# EAGLE board power_distribution (EAGLE 9.6.2), part 1 of 3
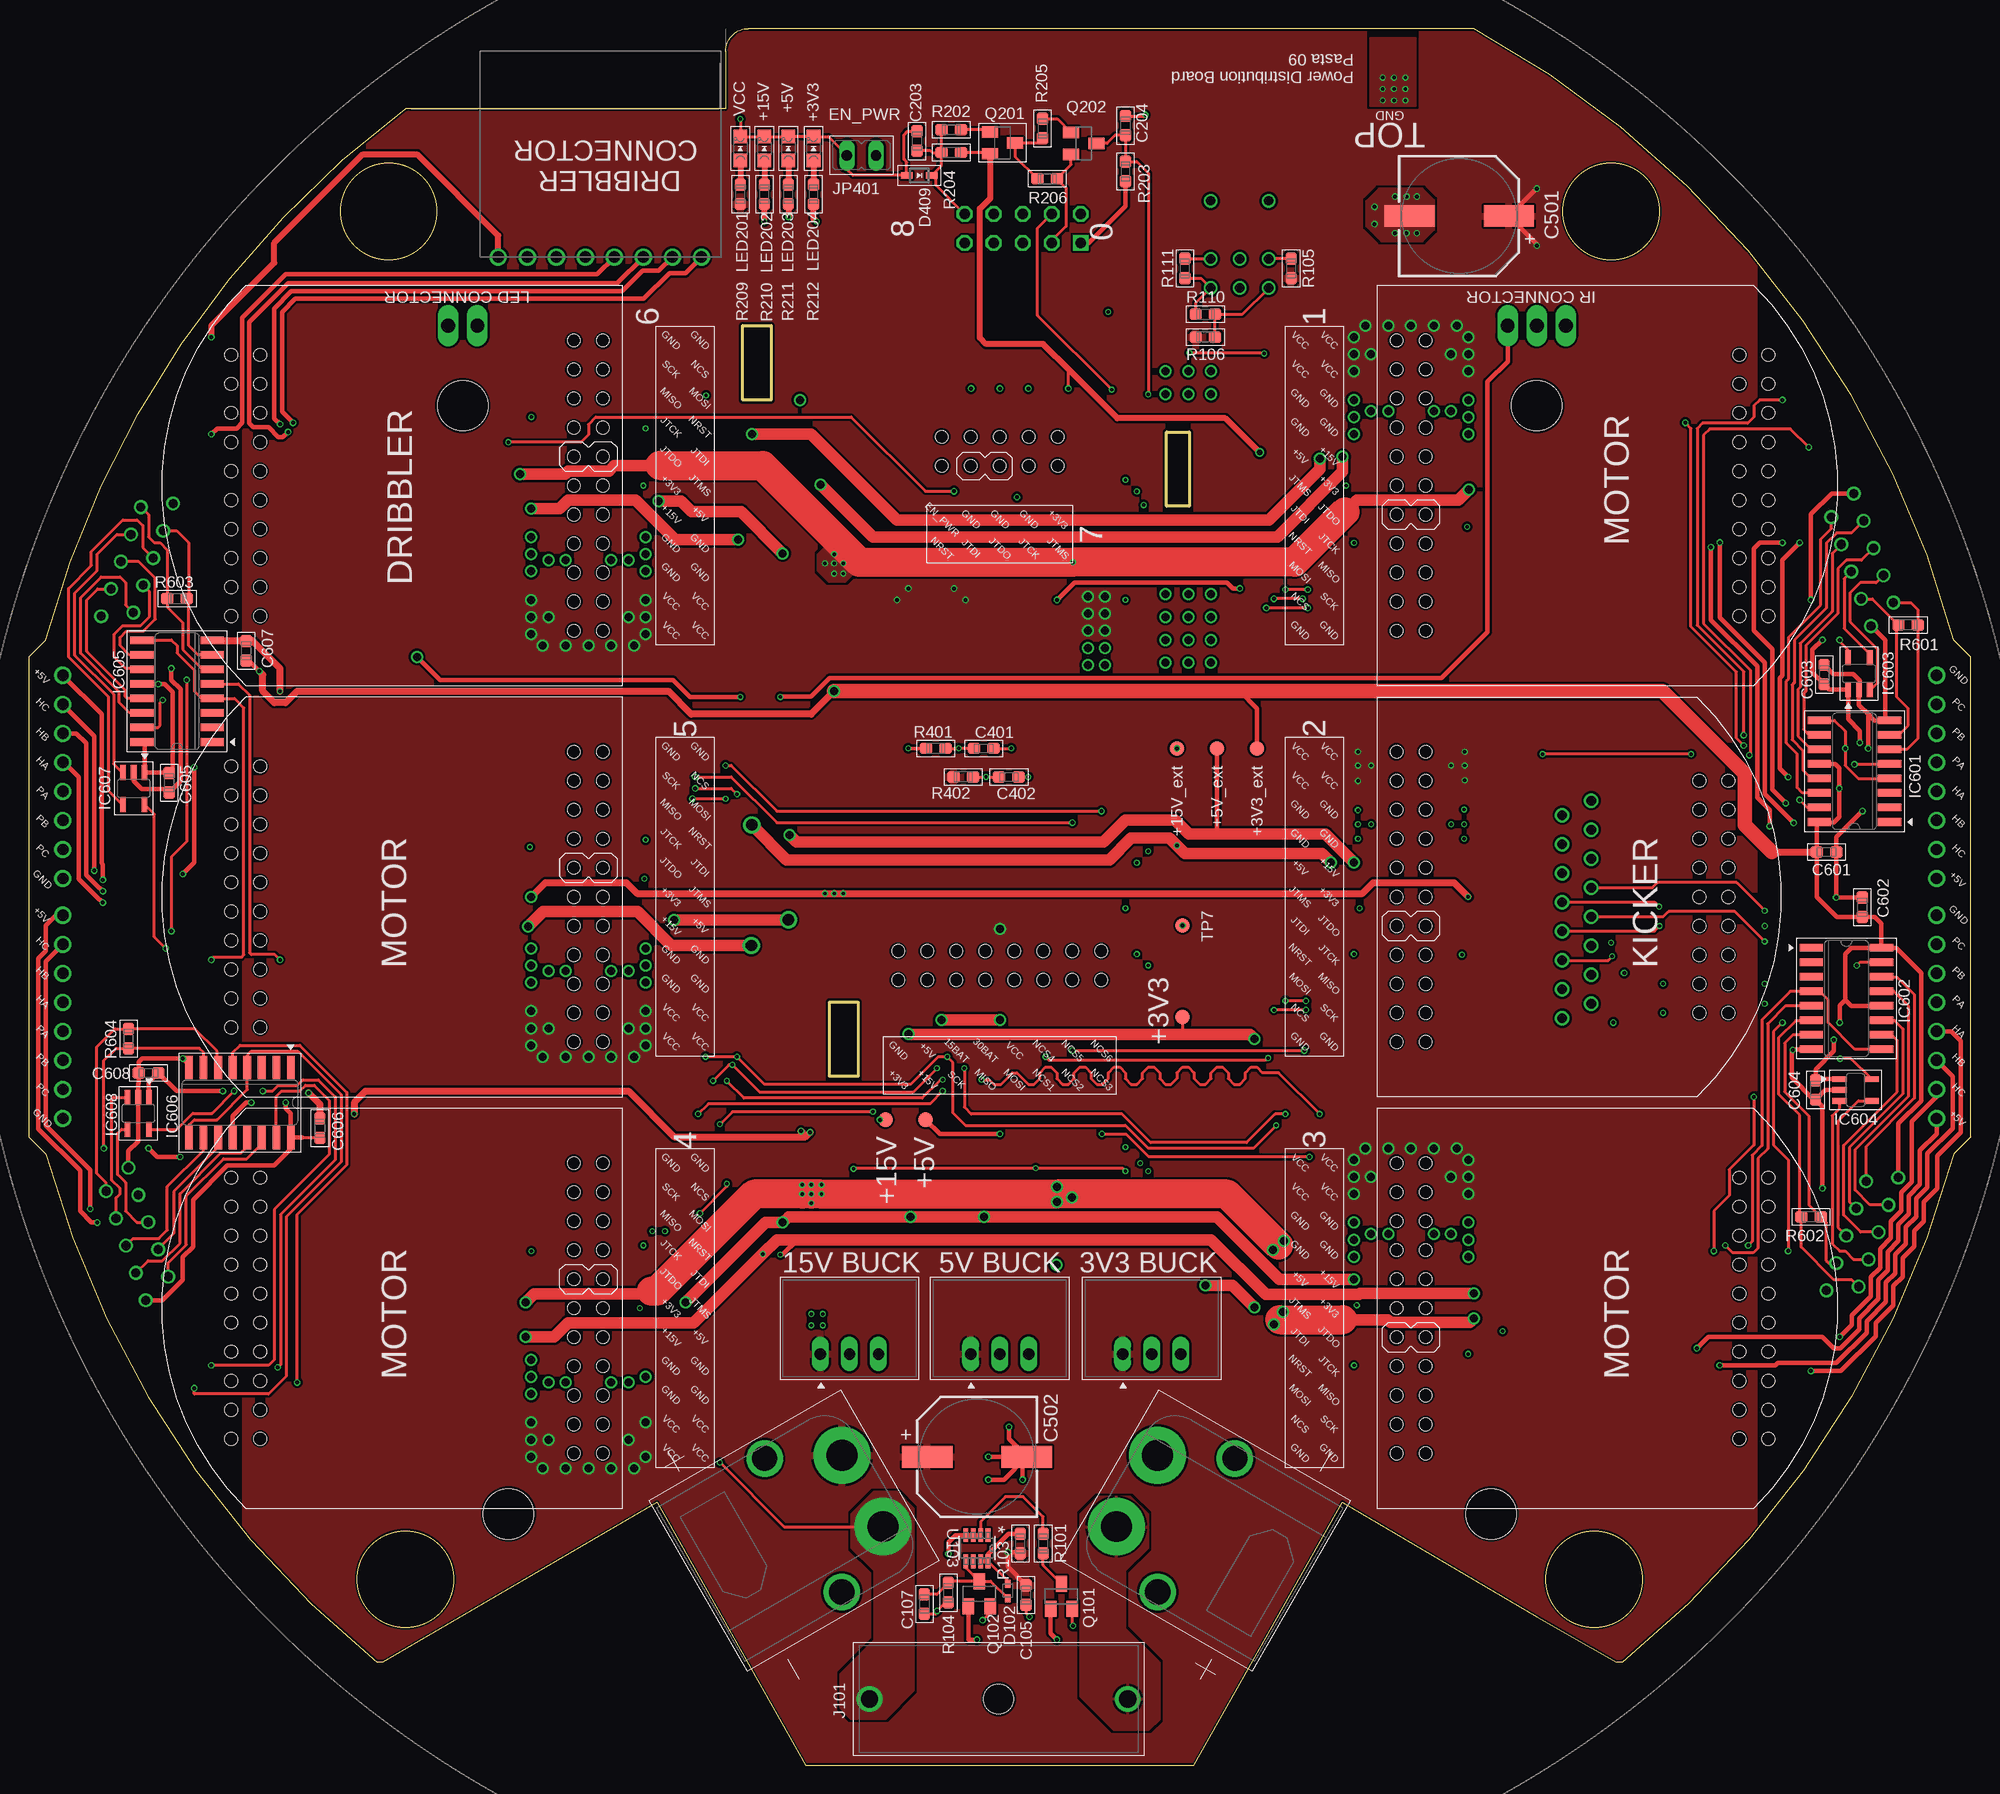
[diagram p7: board, top side]
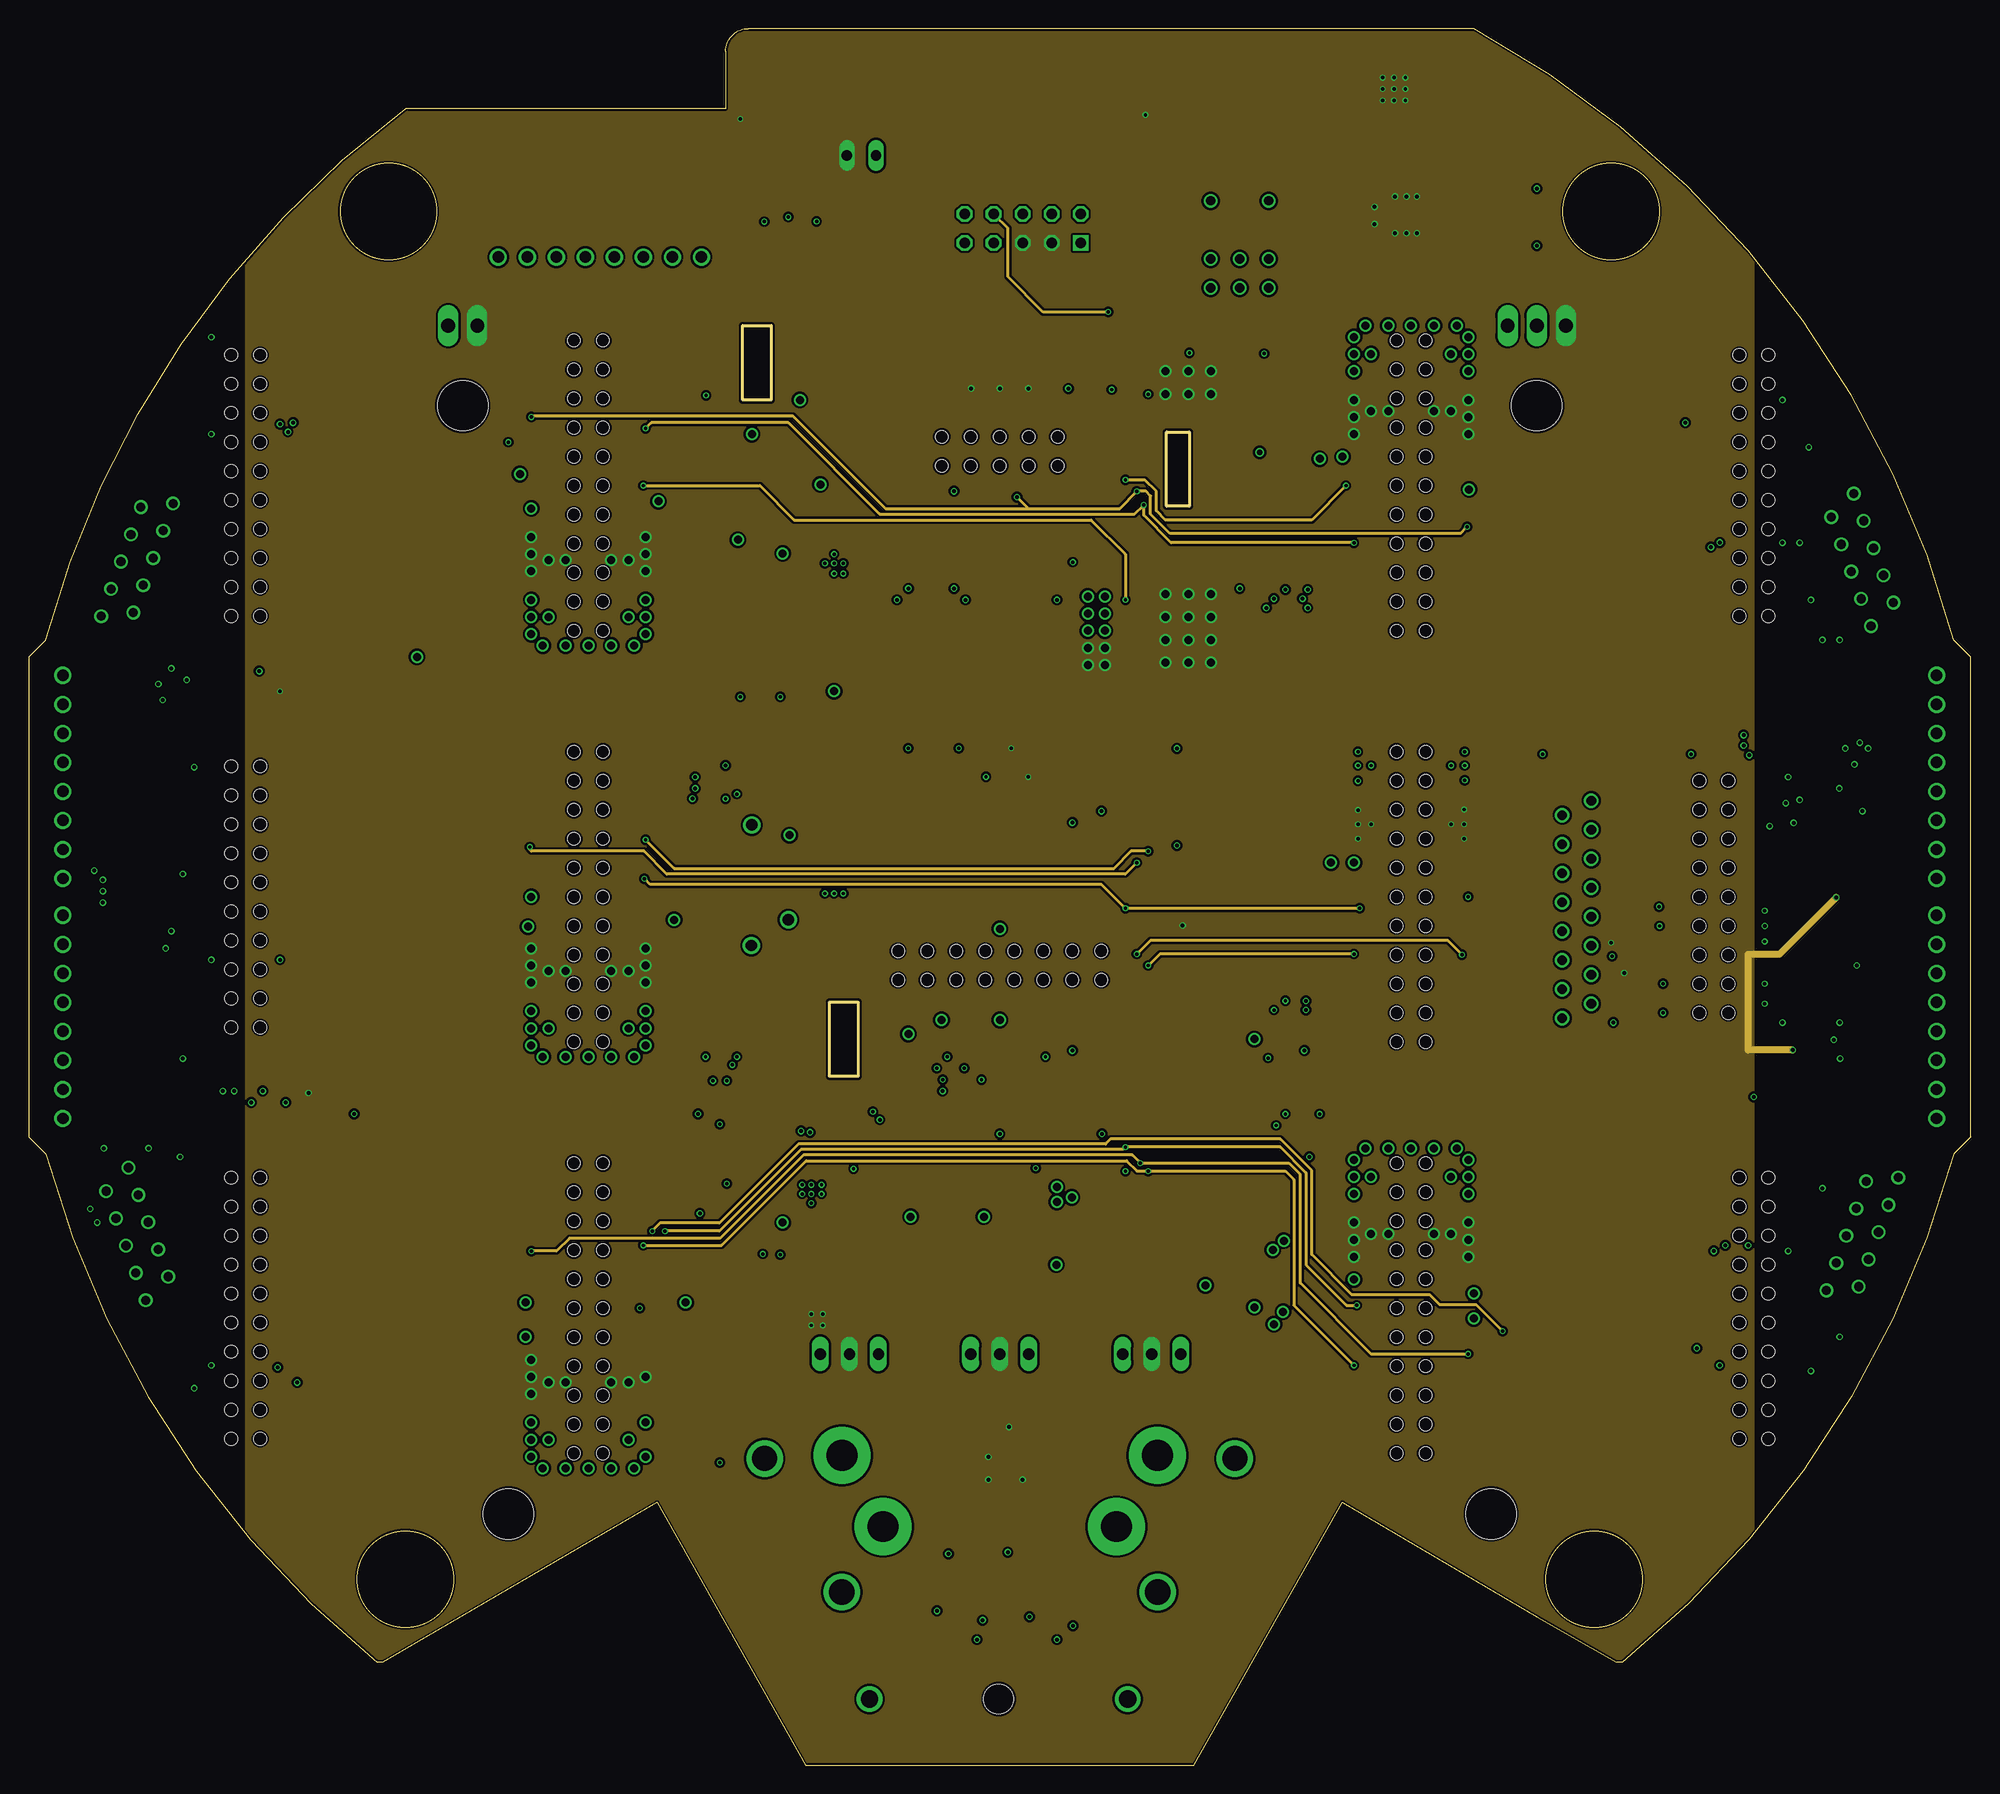
[diagram p8: board, inner layer Route2]
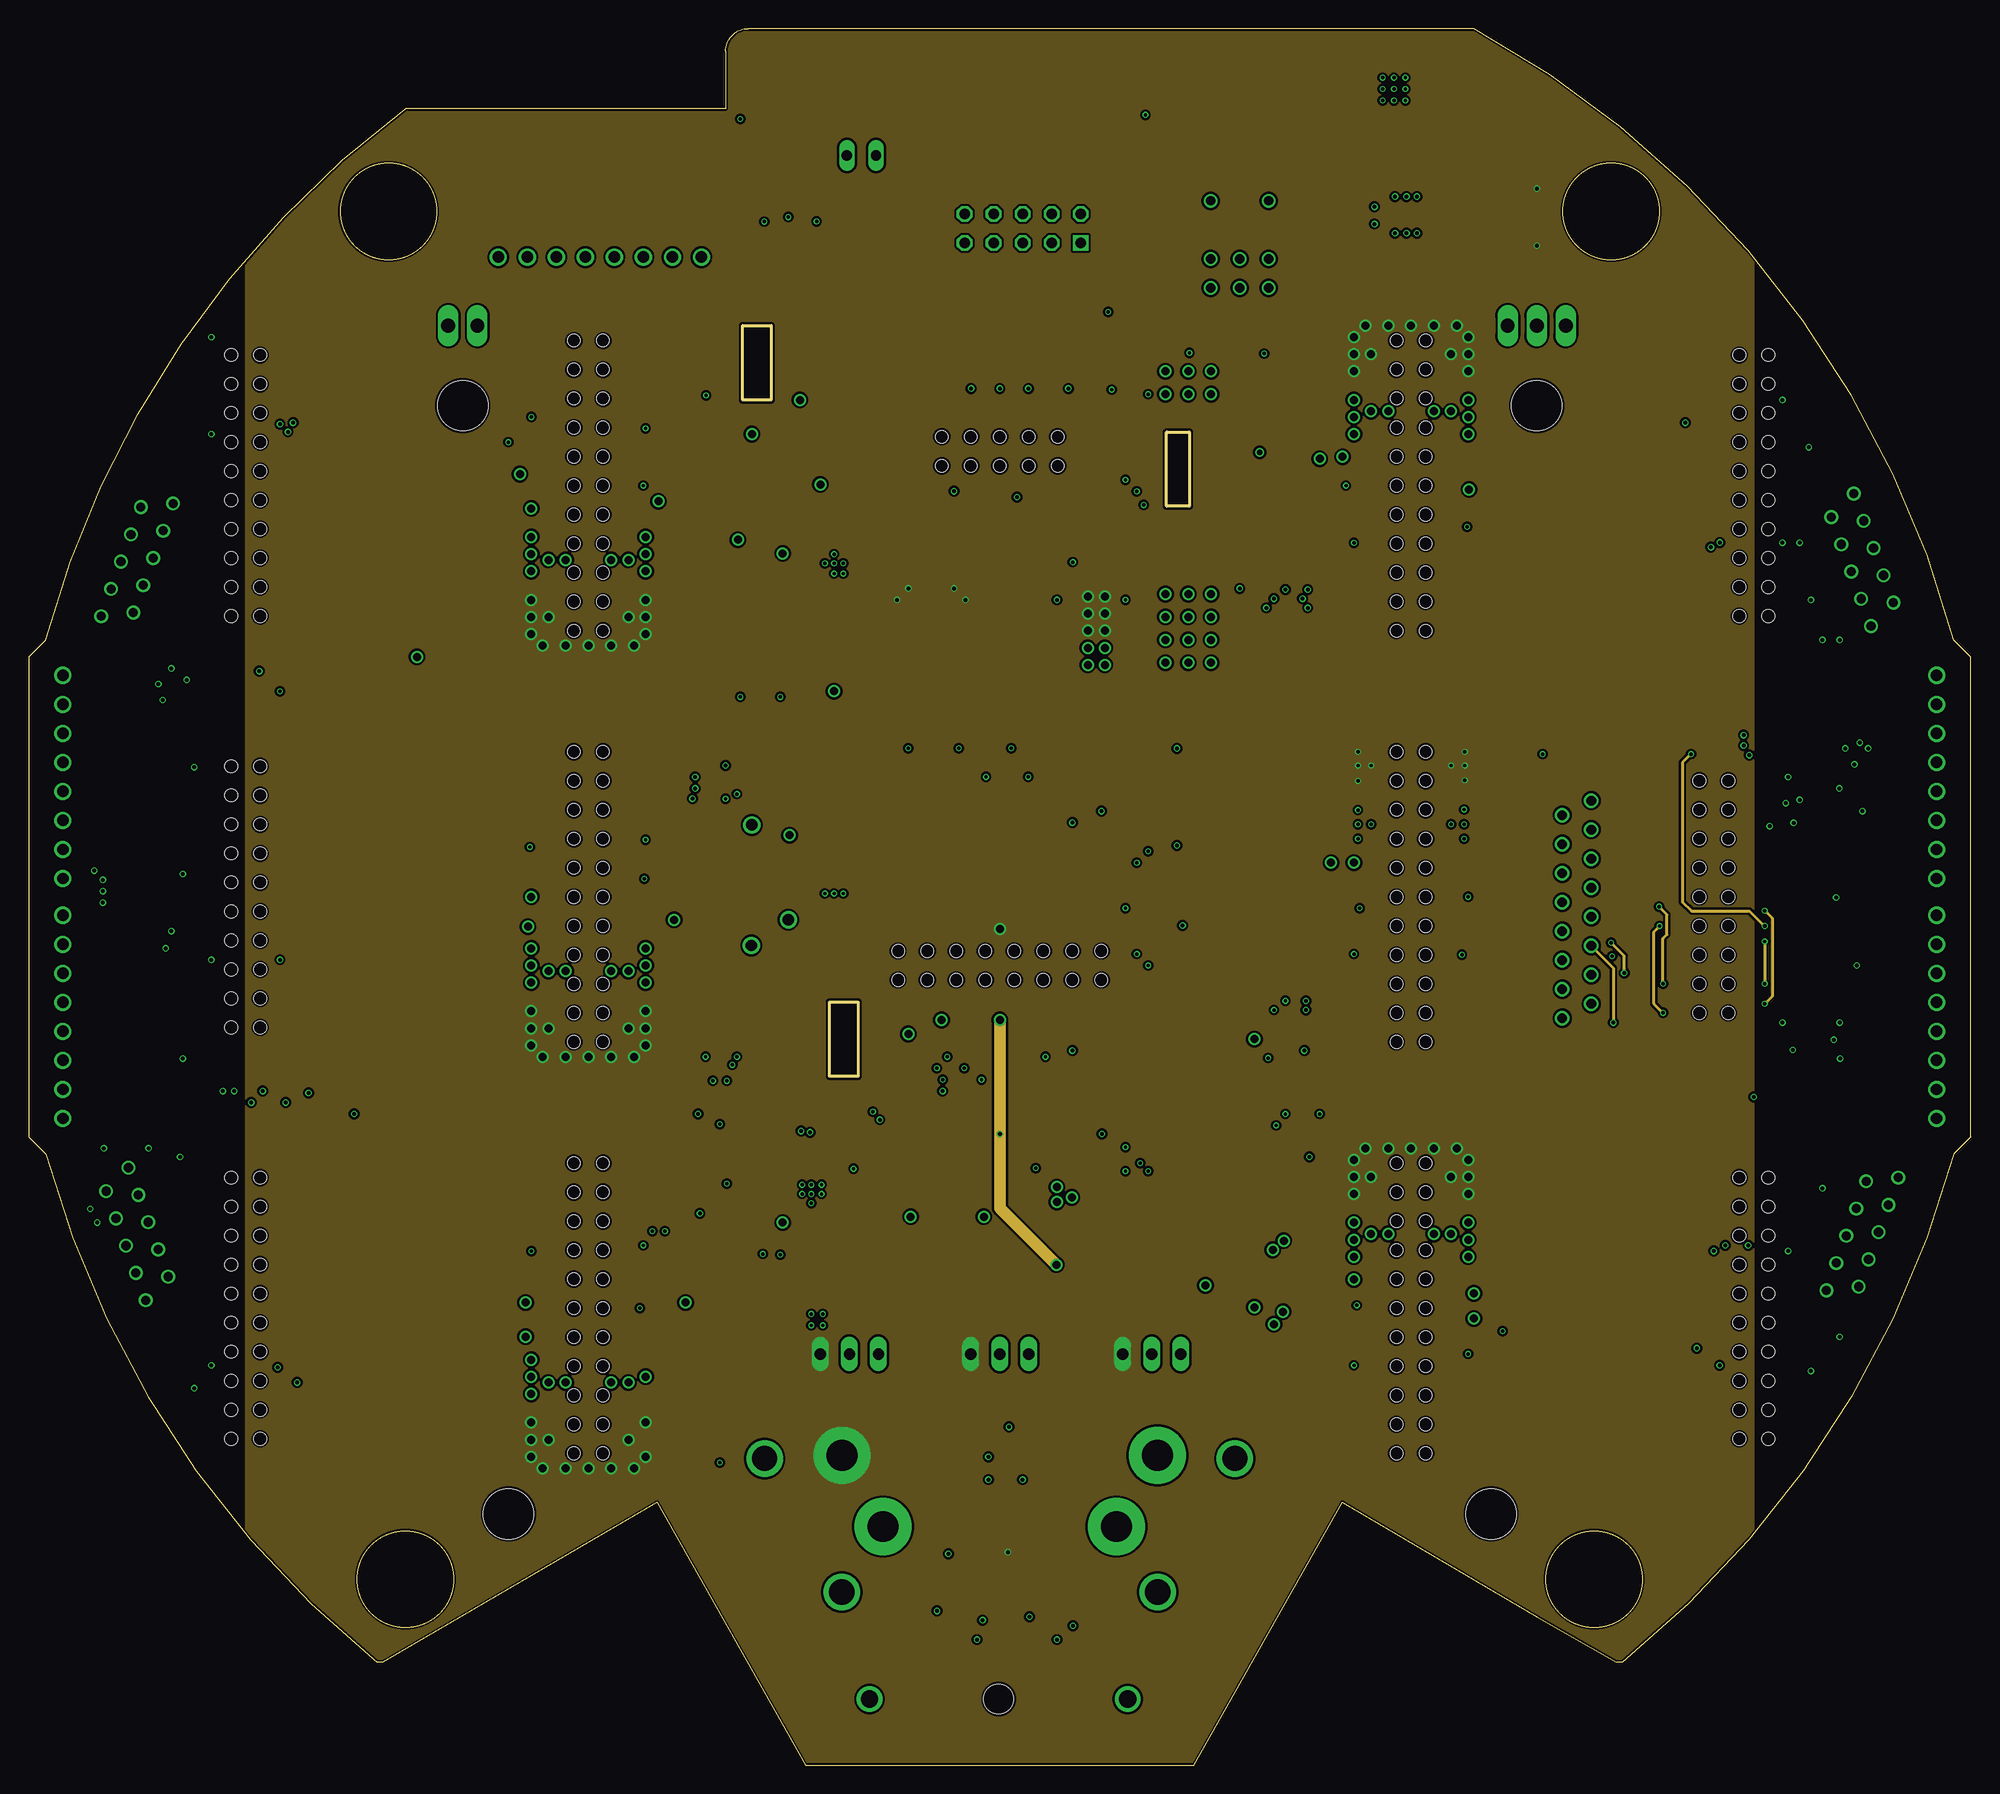
[diagram p9: board, inner layer Route15]
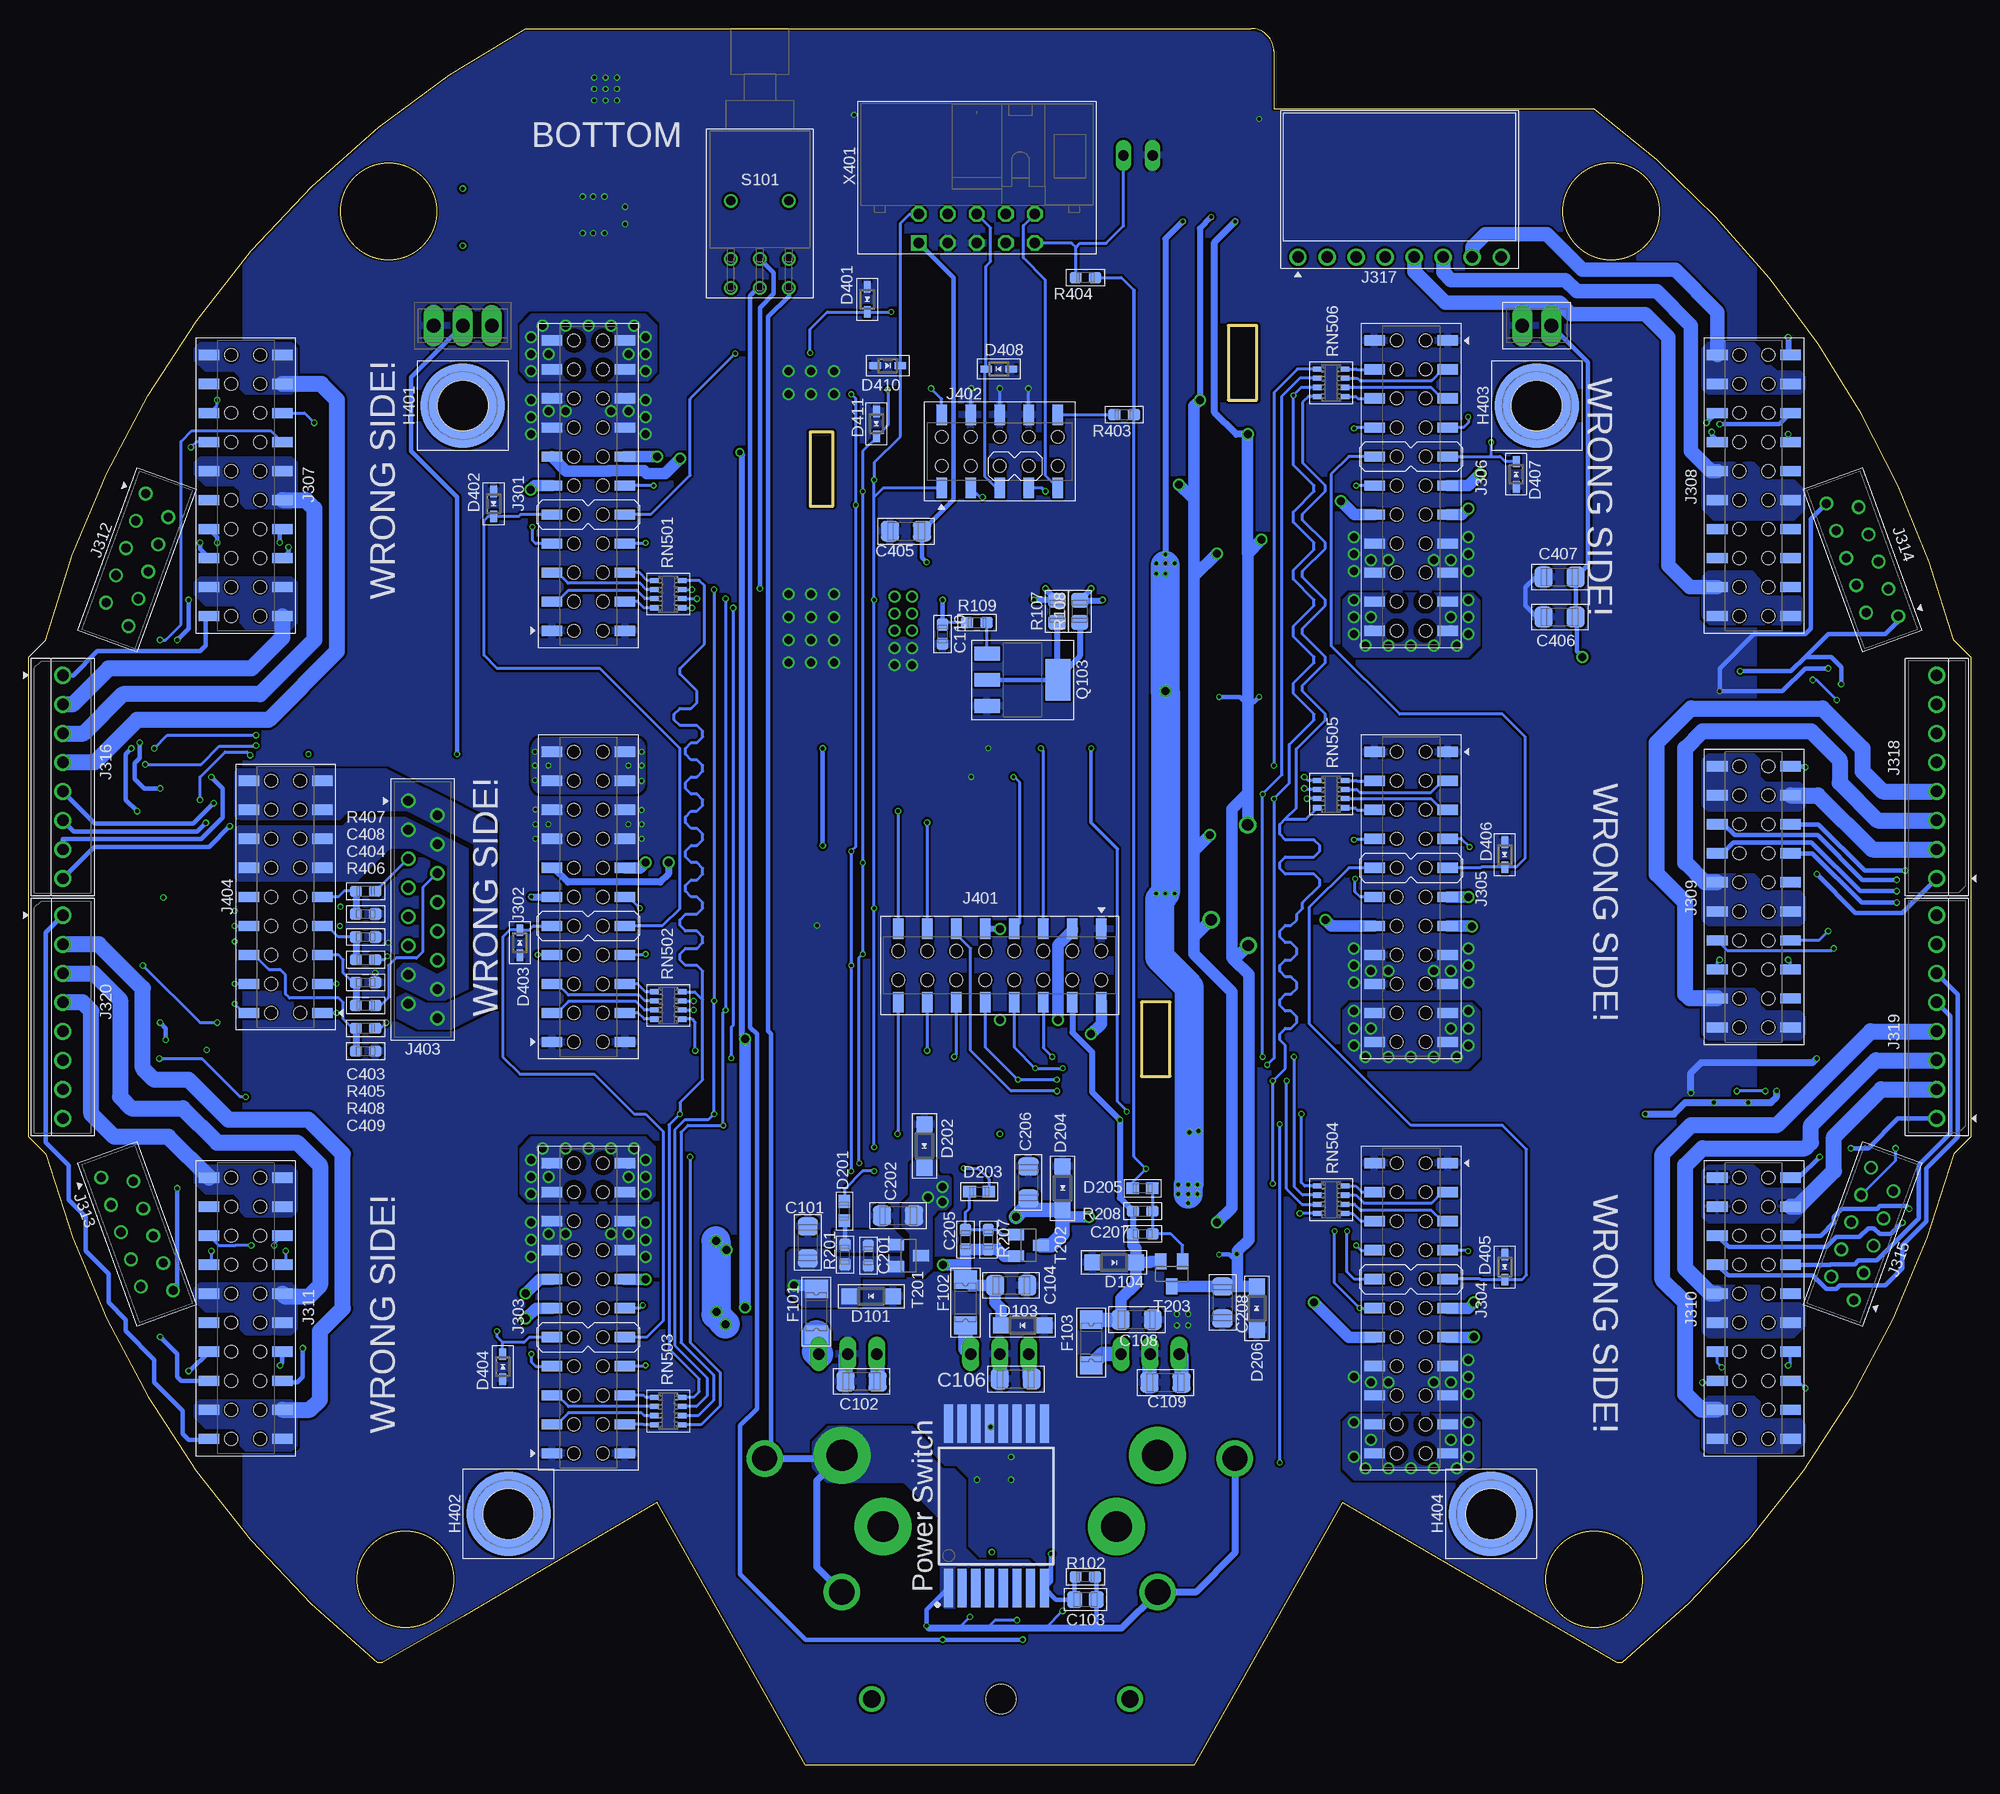
[diagram p10: board, bottom side, seen from below]

Size 170 x 152 mm. Coordinates in mm from the lower left corner, seen from the top.
Outline: 126.5,152 63,152 arc90 61,150 61,145 33,145 arc38 1.5,98.5 0,97 0,55 1.5,53.5 arc36 30.5,9 31,9 55,23 68,0 102,0 115,23 132,13 139,9 139.5,9 arc36 168.5,53.5 170,55 170,97 168.5,98.5 arc46 126.5,152
Outline: circle at 137.02,16.28 radius 4.2
Outline: circle at 138.5,136 radius 4.2
Outline: circle at 31.5,136 radius 4.2
Outline: circle at 32.98,16.28 radius 4.2
Outline: circle at 137.02,16.28 radius 4.2
Outline: circle at 138.5,136 radius 4.2
Outline: circle at 31.5,136 radius 4.2
Outline: circle at 32.98,16.28 radius 4.2
Copper layers (1+2*15+16): Top 0.07mm / dielectric 0.175mm / Route2 0.07mm / dielectric 1.13mm / Route15 0.07mm / dielectric 0.175mm / Bottom 0.07mm
Design rules "power_distribution": minimum track width 8mil, minimum drill 0.2mm, track to track 8mil, track to pad 8mil, pad to pad 8mil, via to via 8mil, smd to smd 0mil, copper to edge 0.2mm, drill to drill 8mil, minimum pad ring 0.1mm, minimum via ring 0.1mm, stop-mask expansion 0.05mm, vias tented up to drill 0.45mm, thermal gap 0.2mm
Net classes: 0 default: width 0.254 mm, drill 0.3 mm, clearance 0.1 mm; 1 drills: drill 3.2 mm, clearance 0.1 mm to class 0

## Footprints (pad centres in the part's own frame; a part is rotated, then mirrored left to right if it is on the bottom)
C1206 = smd 1.6 x 1.8: 1 -1.4,0; 2 1.4,0
C0805 = smd 1.3 x 1.5: 1 -0.95,0; 2 0.95,0
C0603 = smd 1.1 x 1: 1 -0.85,0; 2 0.85,0
WCAP-AS5H_10X10.5(DXL) = smd 4.4 x 1.9: 1 4.35,0; 2 -4.35,0
XT60PW-M = drill 2.7 pad 5: CON+ 3.6,-6; CON- -3.6,-6 | drill 2.2: S1 6.75,0; S2 -6.75,0
SOD123 = smd 1.4 x 1.4: A 1.9,0; C -1.9,0
SOD523 = smd 0.7 x 0.5: A 0.7,0; C -0.6,0
0603 = smd 1.1 x 1: 1 -0.85,0; 2 0.85,0
SOD-323 = smd 1 x 0.6: 1 -1.1,0; 2 1.1,0
MF-NSMF-1 = smd 1.6 x 2: 1 -2,0; 2 2,0
9774***360 = smd 7.4 x 7.4: 1 0,0 | hole 4.4: 0,0
TRACO_POWER_3_PIN = drill 1 long: 1 -2.54,0; 2 0,0; 3 2.54,0
SO16 = smd 0.66 x 2.032: 1 -4.445,-3.073; 2 -3.175,-3.073; 3 -1.905,-3.073; 4 -0.635,-3.073; 5 0.635,-3.073; 6 1.905,-3.073; 7 3.175,-3.073; 8 4.445,-3.073; 9 4.445,3.073; 10 3.175,3.073; 11 1.905,3.073; 12 0.635,3.073; 13 -0.635,3.073; 14 -1.905,3.073; 15 -3.175,3.073; 16 -4.445,3.073
SOT23-5 = smd 0.5 x 1.3: 1 -0.95,-1.4; 2 0,-1.4; 3 0.95,-1.4; 4 0.95,1.4; 5 -0.95,1.4
696107003002 = drill 1.5: 1 -11.3,0; 2 11.3,0 | hole 2.6: 0,0
610022243021 = smd 0.9 x 1.8: 1 -12.7,3.2; 2 -10.16,3.2; 3 -7.62,3.2; 4 -5.08,3.2; 5 -2.54,3.2; 6 0,3.2; 7 2.54,3.2; 8 5.08,3.2; 9 7.62,3.2; 10 10.16,3.2; 11 12.7,3.2; 12 12.7,-3.2; 13 10.16,-3.2; 14 7.62,-3.2; 15 5.08,-3.2; 16 2.54,-3.2; 17 0,-3.2; 18 -2.54,-3.2; 19 -5.08,-3.2; 20 -7.62,-3.2; 21 -10.16,-3.2; 22 -12.7,-3.2 | hole 1.1: -12.7,1.27; -10.16,1.27; -10.16,-1.27; -12.7,-1.27; -7.62,1.27; -7.62,-1.27; -5.08,1.27; -5.08,-1.27; -2.54,1.27; -2.54,-1.27; 0,1.27; 0,-1.27; 2.54,1.27; 2.54,-1.27; 5.08,1.27; 5.08,-1.27; 7.62,1.27; 7.62,-1.27; 10.16,1.27; 10.16,-1.27; 12.7,1.27; 12.7,-1.27
610X20243021 = smd 0.9 x 1.8: 1 -11.43,-3.2; 2 -11.43,3.2; 3 -8.89,-3.2; 4 -8.89,3.2; 5 -6.35,-3.2; 6 -6.35,3.2; 7 -3.81,-3.2; 8 -3.81,3.2; 9 -1.27,-3.2; 10 -1.27,3.2; 11 1.27,-3.2; 12 1.27,3.2; 13 3.81,-3.2; 14 3.81,3.2; 15 6.35,-3.2; 16 6.35,3.2; 17 8.89,-3.2; 18 8.89,3.2; 19 11.43,-3.2; 20 11.43,3.2 | hole 1.1: -11.43,1.27; -8.89,1.27; -8.89,-1.27; -11.43,-1.27; -6.35,1.27; -6.35,-1.27; -3.81,1.27; -3.81,-1.27; -1.27,-1.27; -1.27,1.27; 1.27,1.27; 1.27,-1.27; 3.81,-1.27; 3.81,1.27; 6.35,1.27; 6.35,-1.27; 8.89,1.27; 8.89,-1.27; 11.43,1.27; 11.43,-1.27
690368171072 = drill 0.8: 1 5.715,1.27; 2 4.445,-1.27; 3 3.175,1.27; 4 1.905,-1.27; 5 0.635,1.27; 6 -0.635,-1.27; 7 -1.905,1.27; 8 -3.175,-1.27; 9 -4.445,1.27; 10 -5.715,-1.27
66100811622 = drill 1: 1 8.89,0; 2 6.35,0; 3 3.81,0; 4 1.27,0; 5 -1.27,0; 6 -3.81,0; 7 -6.35,0; 8 -8.89,0
66100811722 = drill 1: 1 8.89,0; 2 6.35,0; 3 3.81,0; 4 1.27,0; 5 -1.27,0; 6 -3.81,0; 7 -6.35,0; 8 -8.89,0
610X16243021 = smd 0.9 x 1.8: 1 -8.89,-3.2; 2 -8.89,3.2; 3 -6.35,-3.2; 4 -6.35,3.2; 5 -3.81,-3.2; 6 -3.81,3.2; 7 -1.27,-3.2; 8 -1.27,3.2; 9 1.27,-3.2; 10 1.27,3.2; 11 3.81,-3.2; 12 3.81,3.2; 13 6.35,-3.2; 14 6.35,3.2; 15 8.89,-3.2; 16 8.89,3.2 | hole 1.1: -8.89,1.27; -6.35,1.27; -6.35,-1.27; -8.89,-1.27; -3.81,1.27; -3.81,-1.27; -1.27,1.27; -1.27,-1.27; 1.27,-1.27; 1.27,1.27; 3.81,1.27; 3.81,-1.27; 6.35,-1.27; 6.35,1.27; 8.89,1.27; 8.89,-1.27
610X10243021 = smd 0.9 x 1.8: 1 -5.08,-3.2; 2 -5.08,3.2; 3 -2.54,-3.2; 4 -2.54,3.2; 5 0,-3.2; 6 0,3.2; 7 2.54,-3.2; 8 2.54,3.2; 9 5.08,-3.2; 10 5.08,3.2 | hole 1.1: -5.08,1.27; -2.54,1.27; -2.54,-1.27; -5.08,-1.27; 0,1.27; 0,-1.27; 2.54,1.27; 2.54,-1.27; 5.08,-1.27; 5.08,1.27
690367181672 = drill 0.85: 1 9.525,1.27; 2 8.255,-1.27; 3 6.985,1.27; 4 5.715,-1.27; 5 4.445,1.27; 6 3.175,-1.27; 7 1.905,1.27; 8 0.635,-1.27; 9 -0.635,1.27; 10 -1.905,-1.27; 11 -3.175,1.27; 12 -4.445,-1.27; 13 -5.715,1.27; 14 -6.985,-1.27; 15 -8.255,1.27; 16 -9.525,-1.27
610X18243021 = smd 0.9 x 1.8: 1 -10.16,-3.2; 2 -10.16,3.2; 3 -7.62,-3.2; 4 -7.62,3.2; 5 -5.08,-3.2; 6 -5.08,3.2; 7 -2.54,-3.2; 8 -2.54,3.2; 9 0,-3.2; 10 0,3.2; 11 2.54,-3.2; 12 2.54,3.2; 13 5.08,-3.2; 14 5.08,3.2; 15 7.62,-3.2; 16 7.62,3.2; 17 10.16,-3.2; 18 10.16,3.2 | hole 1.1: -10.16,1.27; -7.62,1.27; -7.62,-1.27; -10.16,-1.27; -5.08,1.27; -5.08,-1.27; -2.54,1.27; -2.54,-1.27; 0,-1.27; 0,1.27; 2.54,1.27; 2.54,-1.27; 5.08,-1.27; 5.08,1.27; 7.62,1.27; 7.62,-1.27; 10.16,1.27; 10.16,-1.27
JP1 = drill 0.914 long: 1 0,-1.27; 2 0,1.27
CHIPLED_0805 = smd 1.2 x 1.2: A 0,-1.05; C 0,1.05
SOT23 = smd 1 x 1.4: 1 -0.95,-1.1; 2 0.95,-1.1; 3 0,1.1
SOT223 = smd 1.219 x 2.235: 1 -2.311,-3.099; 2 0,-3.099; 3 2.311,-3.099 | smd 3.6 x 2.2: 4 0,3.099
SOT23-BEC = smd 1 x 1.4: B -0.95,-1.1; C 0,1.1; E 0.95,-1.1
R0603 = smd 1.1 x 1: 1 -0.85,0; 2 0.85,0
R0805 = smd 1.3 x 1.5: 1 -0.95,0; 2 0.95,0
EXB38 = smd 0.45 x 0.8: 1-1 -1.2,-1.2; 1-2 -1.2,1.2; 2-1 -0.4,-1.2; 2-2 -0.4,1.2; 3-1 0.4,-1.2; 3-2 0.4,1.2; 4-1 1.2,-1.2; 4-2 1.2,1.2
BB26AH = drill 0.8: S1 -2.54,13.7; S2 0,13.7; S3 2.54,13.7; S4 -2.54,11.16; S5 0,11.16; S6 2.54,11.16; S7 -2.54,6.08; S8 2.54,6.08
SOIC120P1500X235-16N-1-V = smd 3.375 x 0.8: 1 -7.187,4.2; 2 -7.187,3; 3 -7.187,1.8; 4 -7.187,0.6; 5 -7.187,-0.6; 6 -7.187,-1.8; 7 -7.187,-3; 8 -7.187,-4.2; 9 7.187,-4.2; 10 7.187,-3; 11 7.187,-1.8; 12 7.187,-0.6; 13 7.187,0.6; 14 7.187,1.8; 15 7.187,3; 16 7.187,4.2
B2,54 = smd 1.27 x 1.27: TP 0,0
FDSM-173XXXX42 = drill 1 long: 1 -2.54,0; 2 0,0; 3 2.54,0
TSOT-23_TS8 = smd 1.219 x 0.406: 1 -1.143,0.975; 2 -1.143,0.325; 3 -1.143,-0.325; 4 -1.143,-0.975; 5 1.143,-0.975; 6 1.143,-0.325; 7 1.143,0.325; 8 1.143,0.975
ML10R = drill 0.914 square: 1 -5.08,-1.27 | drill 0.914 octagon: 2 -5.08,1.27; 3 -2.54,-1.27; 4 -2.54,1.27; 5 0,-1.27; 6 0,1.27; 7 2.54,-1.27; 8 2.54,1.27; 9 5.08,-1.27; 10 5.08,1.27
3POL254 = drill 1.2 long: 1 -2.54,0; 2 0,0; 3 2.54,0
2POL254 = drill 1.2 long: 1 -1.27,0; 2 1.27,0

## Placement (x,y rotation side)
C101  10u ±20% 50V X5R  [C1206]  101.8,45.75 90 bottom
C102  10u ±20% 50V X5R  [C1206]  97.1,33.6 180 bottom
C103  4u7 ±10% 50V X5R  [C0805]  77.5,14.5 0 bottom
C104  10u ±20% 50V X5R  [C1206]  84,42 0 bottom
C105  1u ±10% 50V X5R  [C0603]  87.3,14.9 270 top
C106  10u ±20% 50V X5R  [C1206]  83.6,33.8 180 bottom
C107  10n ±10% 50V X7R  [C0603]  78.4,14.1 270 top
C108  10u ±20% 50V X5R  [C1206]  73,39 0 bottom
C109  10u ±20% 50V X5R  [C1206]  70.5,33.5 180 bottom
C110  470n ±10% 25V X7R  [C0603]  90,99 270 bottom
C201  100n ±10% 50V X7R  [C0603]  96.5,44.6 90 bottom
C202  10u ±20% 50V X5R  [C1206]  93.9,48.1 180 bottom
C203  10n ±10% 50V X7R  [C0603]  77.75,142.15 90 top
C204  470n ±10% 50V X7R  [C0603]  96,143.5 90 top
C205  100n ±10% 50V X7R  [C0603]  88,46 90 bottom
C206  10u ±20% 50V X5R  [C1206]  82.5,51 90 bottom
C207  100n ±10% 50V X7R  [C0603]  72.5,46.5 0 bottom
C208  10u ±20% 50V X5R  [C1206]  65.5,40.5 270 bottom
C401  100n ±10% 50V X7R  [C0603]  83.6,89 0 top
C402  100n ±10% 50V X7R  [C0603]  85.8,86.5 0 top
C403  100n ±10% 50V X7R  [C0603]  140.5,68.5 0 bottom
C404  100n ±10% 50V X7R  [C0603]  140.5,72.5 180 bottom
C405  10u ±20% 50V X5R  [C1206]  93.2,108 180 bottom
C406  10u ±20% 50V X5R  [C1206]  36,100.5 180 bottom
C407  10u ±20% 50V X5R  [C1206]  36,104 180 bottom
C408  100n ±10% 50V X7R  [C0603]  140.5,74.5 0 bottom
C409  100n ±10% 50V X7R  [C0603]  140.5,62.5 0 bottom
C501  330 µF  [WCAP-AS5H_10X10.5(DXL)]  125.2,135.6 0 top
C502  330 µF  [WCAP-AS5H_10X10.5(DXL)]  83,27 180 top
C601  100n ±10% 50V X7R  [C0603]  157.37,79.92 0 top
C602  100n ±10% 50V X7R  [C0603]  160.5,75.1 90 top
C603  100n ±10% 50V X7R  [C0603]  157.15,95.46 90 top
C604  100n ±10% 50V X7R  [C0603]  156.4,59.1 270 top
C605  100n ±10% 50V X7R  [C0603]  12.3,86 270 top
C606  100n ±10% 50V X7R  [C0603]  25.5,55.75 90 top
C607  100n ±10% 50V X7R  [C0603]  19.05,97.55 90 top
C608  100n ±10% 50V X7R  [C0603]  10.5,60.6 180 top
CON101  XT60PW  [XT60PW-M]  67.8,21 120 top
CON102  XT60PW  [XT60PW-M]  102.2,21 240 top
D101  PTVS3V3S1UR  [SOD123]  96.25,41.05 0 bottom
D102  1N4148X-TP  [SOD523]  85.7,15.3 270 top
D103  PTVS5V0S1UR  [SOD123]  83,38.5 0 bottom
D104  PTVS15VS1UR  [SOD123]  75,44 180 bottom
D201  CDBU0130L  [0603]  98.6,48.5 90 bottom
D202  PTVS3V3S1UR  [SOD123]  91.6,54.2 90 bottom
D203  CDBU0130L  [0603]  86.8,50.2 0 bottom
D204  PTVS5V0S1UR  [SOD123]  79.5,50.5 90 bottom
D205  CDBU0130L  [0603]  72.5,50.5 180 bottom
D206  PTVS15VS1UR  [SOD123]  62.5,40 270 bottom
D401  CDSOD323  [SOD-323]  96.6,128.3 90 bottom
D402  CDSOD323  [SOD-323]  129.3,110.4 90 bottom
D403  CDSOD323  [SOD-323]  127,72 270 bottom
D404  CDSOD323  [SOD-323]  128.5,34.9 270 bottom
D405  CDSOD323  [SOD-323]  40.8,43.6 90 bottom
D406  CDSOD323  [SOD-323]  40.8,79.7 90 bottom
D407  CDSOD323  [SOD-323]  39.8,113 270 bottom
D408  CDSOD323  [SOD-323]  85.1,122.2 0 bottom
D409  CDSOD323  [SOD-323]  77.95,139.15 180 top
D410  CDSOD323  [SOD-323]  94.8,122.5 180 bottom
D411  CDSOD323  [SOD-323]  95.8,117.4 90 bottom
F101  1.1A  [MF-NSMF-1]  101.05,39.7 90 bottom
F102  1.1A  [MF-NSMF-1]  88,40.5 90 bottom
F103  1.1A  [MF-NSMF-1]  77,37 90 bottom
H401  [9774***360]  132,119 90 bottom
H402  [9774***360]  128,22 90 bottom
H403  [9774***360]  38,119 90 bottom
H404  [9774***360]  42,22 90 bottom
IC101  TSR 1-24150  [TRACO_POWER_3_PIN]  71.85,36 0 top
IC601  SN65LVDS050D  [SO16]  159.8,87 90 top
IC602  SN65LVDS050D  [SO16]  159.1,67.1 270 top
IC603  LVDS-DRIVER-DS90LV011AQ  [SOT23-5]  160.2,95.55 0 top
IC604  LVDS-DRIVER-DS90LV011AQ  [SOT23-5]  159.9,59.1 270 top
IC605  SN65LVDS050D  [SO16]  13,94 90 top
IC606  SN65LVDS050D  [SO16]  18.5,58 180 top
IC607  LVDS-DRIVER-DS90LV011AQ  [SOT23-5]  9.2,85.5 180 top
IC608  LVDS-DRIVER-DS90LV011AQ  [SOT23-5]  9.6,57.05 180 top
J101  [696107003002]  84.9,5.8 180 top
J301  [610022243021]  121,112 90 bottom
J302  [610022243021]  121,76 90 bottom
J303  [610022243021]  121,40 90 bottom
J304  [610022243021]  49,40 270 bottom
J305  [610022243021]  49,76 270 bottom
J306  [610022243021]  49,112 270 bottom
J307  610020243021  [610X20243021]  151,112 270 bottom
J308  610020243021  [610X20243021]  19,112 90 bottom
J309  610020243021  [610X20243021]  19,76 90 bottom
J310  610020243021  [610X20243021]  19,40 90 bottom
J311  610020243021  [610X20243021]  151,40 270 bottom
J312  [690368171072]  160.5,105.5 70 bottom
J313  [690368171072]  160.5,46.5 110 bottom
J314  [690368171072]  9.5,105.5 290 bottom
J315  [690368171072]  9.5,46.5 250 bottom
J316  [66100811622]  167,86.5 90 bottom
J317  [66100811722]  50,132 180 bottom
J318  [66100811622]  3,86.5 270 bottom
J319  [66100811622]  3,65.5 270 bottom
J320  [66100811622]  167,65.5 90 bottom
J401  610016243021  [610X16243021]  85,70 180 bottom
J402  610010243021  [610X10243021]  85,115 0 bottom
J403  [690367181672]  135.5,74.9 90 bottom
J404  61018243021  [610X18243021]  147.5,76 90 bottom
JP401  [JP1]  72.9,140.9 270 top
LED201  Red  [CHIPLED_0805]  62.3,141.5 0 top
LED202  Blue  [CHIPLED_0805]  64.4,141.5 0 top
LED203  Yellow  [CHIPLED_0805]  66.5,141.5 0 top
LED204  Green  [CHIPLED_0805]  68.7,141.5 0 top
Q101  RUC002N05HZGT116  [SOT23]  90.4,14.8 0 top
Q102  RUC002N05HZGT116  [SOT23]  83.2,15 0 top
Q103  [SOT223]  83,95 270 bottom
Q201  BC857C  [SOT23-BEC]  85.25,142 270 top
Q202  BC847C  [SOT23]  92.35,141.95 270 top
R101  220R ±1% 75V 0.1W  [R0603]  86.8,19.4 270 top
R102  22k ±1% 75V 0.1W  [R0603]  77.5,16.5 180 bottom
R103  100R ±1% 75V 0.1W  [R0603]  88.8,19.4 90 top
R104  1M5 ±1% 75V 0.1W  [R0603]  80.5,15.1 90 top
R105  3k3 ±1% 75V 0.1W  [R0603]  110.5,131 270 top
R106  120k ±1% 75V 0.1W  [R0603]  103,125 180 top
R107  270R ±1% 150V 0.125W  [R0805]  80,101 90 bottom
R108  270R ±1% 150V 0.125W  [R0805]  78,101 90 bottom
R109  10k ±1% 75V 0.1W  [R0603]  87,100 0 bottom
R110  120k ±1% 75V 0.1W  [R0603]  103,127 0 top
R111  100k ±1% 75V 0.1W  [R0603]  101.2,131 90 top
R201  47k ±1% 75V 0.1W  [R0603]  98.55,44.7 270 bottom
R202  1k ±1% 75V 0.1W  [R0603]  80.75,143.15 0 top
R203  4k7 ±1% 75V 0.1W  [R0603]  96,139.5 270 top
R204  47k ±1% 75V 0.1W  [R0603]  80.75,141.15 0 top
R205  22k ±1% 75V 0.1W  [R0603]  88.75,143.25 90 top
R206  100k ±1% 75V 0.1W  [R0603]  89.15,138.85 180 top
R207  47k ±1% 75V 0.1W  [R0603]  86,46 270 bottom
R208  47k ±1% 75V 0.1W  [R0603]  72.5,48.5 180 bottom
R209  10k ±1% 75V 0.1W  [R0603]  62.3,137.5 270 top
R210  10k ±1% 75V 0.1W  [R0603]  64.4,137.5 270 top
R211  1k5 ±1% 75V 0.1W  [R0603]  66.5,137.5 270 top
R212  1k5 ±1% 75V 0.1W  [R0603]  68.7,137.5 270 top
R401  10k ±1% 75V 0.1W  [R0603]  79.4,89 180 top
R402  10k ±1% 75V 0.1W  [R0603]  81.8,86.5 180 top
R403  4k7 ±1% 75V 0.1W  [R0603]  74.1,118.2 180 bottom
R404  1k ±1% 75V 0.1W  [R0603]  77.5,130.2 180 bottom
R405  10k ±1% 75V 0.1W  [R0603]  140.5,66.5 0 bottom
R406  10k ±1% 75V 0.1W  [R0603]  140.5,70.5 0 bottom
R407  10k ±1% 75V 0.1W  [R0603]  140.5,76.5 180 bottom
R408  10k ±1% 75V 0.1W  [R0603]  140.5,64.5 0 bottom
R601  100R ±1% 75V 0.1W  [R0603]  164.51,99.8 0 top
R602  100R ±1% 75V 0.1W  [R0603]  156,48 180 top
R603  100R ±1% 75V 0.1W  [R0603]  13,102.1 180 top
R604  100R ±1% 75V 0.1W  [R0603]  8.75,63.6 90 top
RN501  33R ±5% 50V 0.0625W  [EXB38]  114,102.5 90 bottom
RN502  33R ±5% 50V 0.0625W  [EXB38]  114,66.5 90 bottom
RN503  33R ±5% 50V 0.0625W  [EXB38]  114,31 90 bottom
RN504  33R ±5% 50V 0.0625W  [EXB38]  56,49.5 270 bottom
RN505  33R ±5% 50V 0.0625W  [EXB38]  56,85 270 bottom
RN506  33R ±5% 50V 0.0625W  [EXB38]  56,121 270 bottom
S101  BB26AH-FA  [BB26AH]  106,143 180 bottom
T101  IAUS300N08S5N012-T  [SOIC120P1500X235-16N-1-V]  85.3,22.7 90 bottom
T201  SI2333CDS  [SOT23]  93,44.6 270 bottom
T202  SI2333CDS  [SOT23]  82.5,45.5 270 bottom
T203  SI2347DS  [SOT23]  69.95,43 180 bottom
TP1  PTR1B2,54  [B2,54]  101,65.5 270 top
TP2  PTR1B2,54  [B2,54]  78.5,56.5 270 top
TP3  PTR1B2,54  [B2,54]  75,56.5 270 top
TP4  PTR1B2,54  [B2,54]  107.5,89 270 top
TP5  PTR1B2,54  [B2,54]  104,89 270 top
TP6  PTR1B2,54  [B2,54]  100.5,89 270 top
TP7  PTR1B2,54  [B2,54]  101,73.5 270 top
U101  [FDSM-173XXXX42]  98.3,36 0 top
U102  [FDSM-173XXXX42]  85,36 0 top
U103  LT3082ETS8TRMPBF  [TSOT-23_TS8]  83,19 270 top
X401  [ML10R]  87,134.5 0 bottom
X402  RX  [3POL254]  132,126 180 bottom
X403  TX  [2POL254]  38,126 180 bottom